# EAGLE board FPGA_pin_demo (EAGLE 5.10)
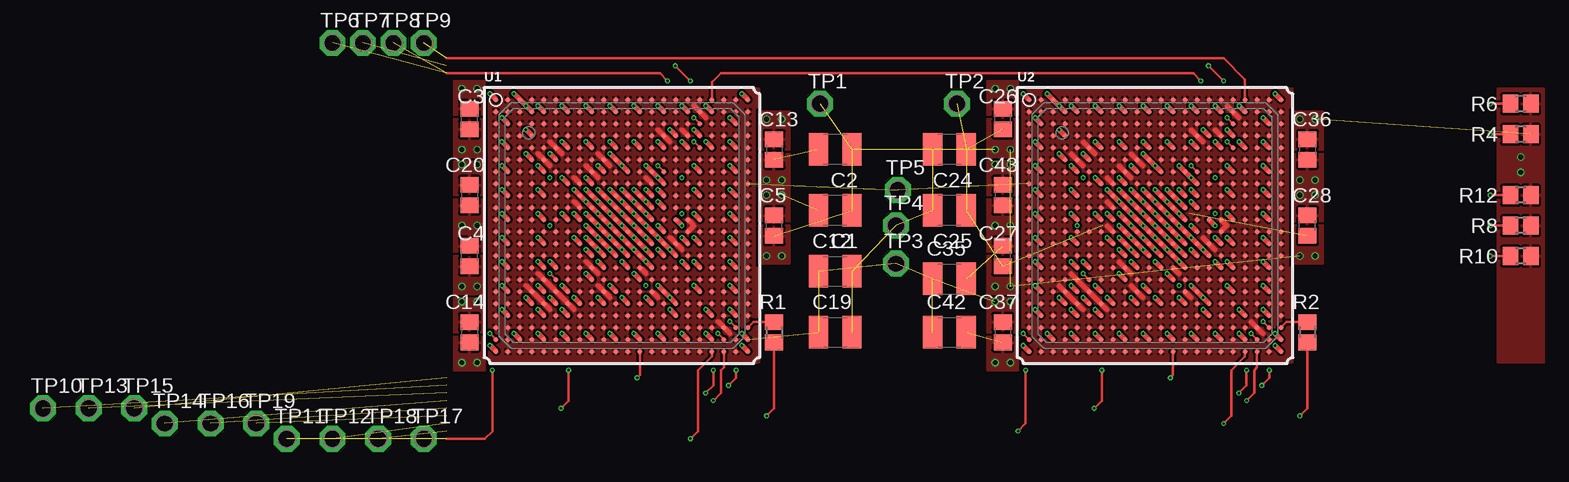
[diagram p5: board, top side]
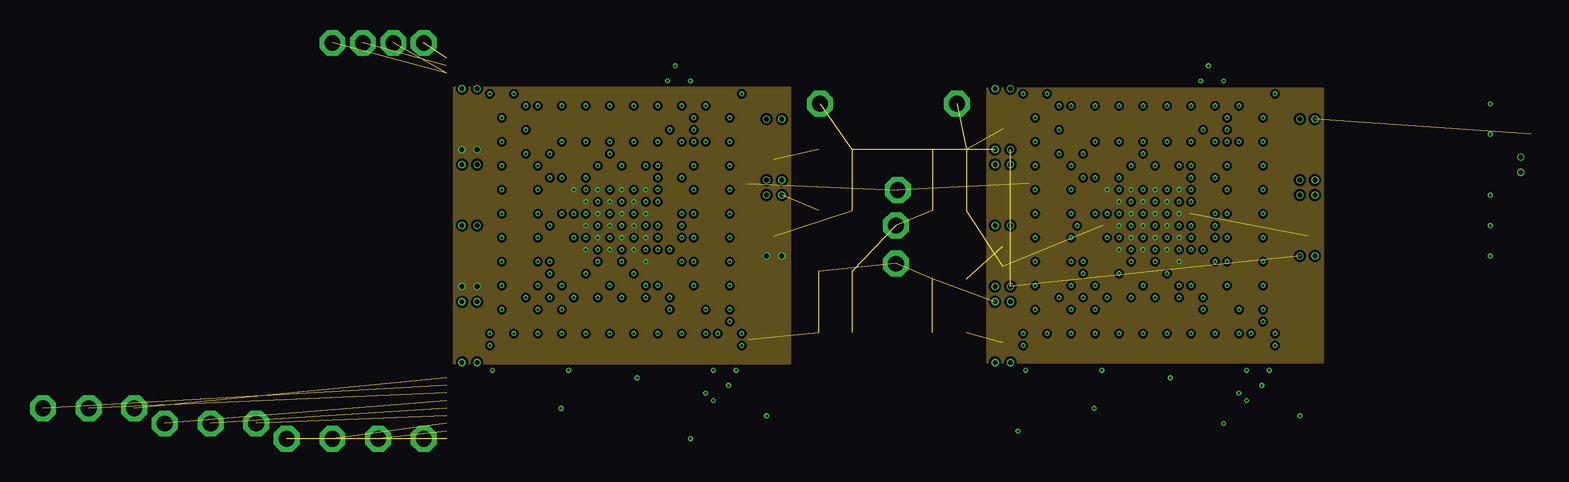
[diagram p6: board, inner layer VCCINT]
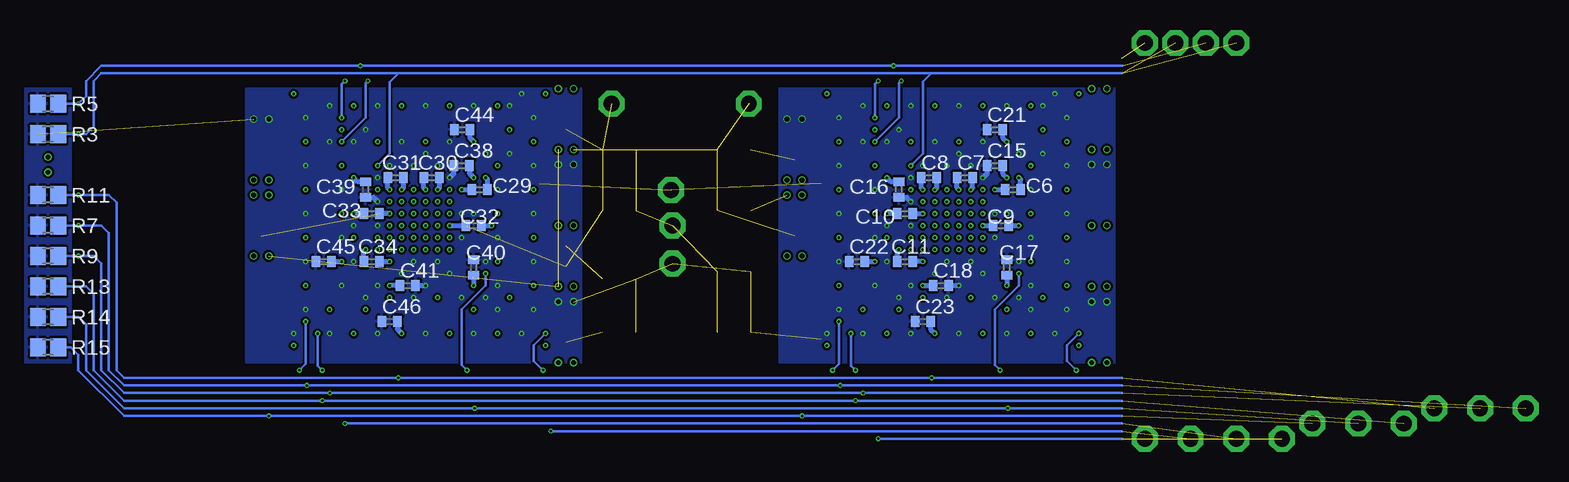
[diagram p7: board, bottom side, seen from below]

No outline drawn. Coordinates in mm, seen from the top.
Copper layers (1+2*15+16): Route1 0.07mm / dielectric 0.11mm / $GND 0.07mm / dielectric 0.7mm / VCCINT 0.07mm / dielectric 0.11mm / Bottom 0.07mm
Design rules "pcbcart": minimum track width 0.2mm, minimum drill 0.2mm, track to track 0.2mm, track to pad 0.2mm, pad to pad 0.2mm, via to via 0.2mm, smd to smd 0.2mm, copper to edge 0.3mm, drill to drill 0.2mm, minimum pad ring 0.1mm, minimum via ring 0.1mm, stop-mask expansion 0.075mm, vias tented up to drill 0mil, thermal gap 0.2mm

## Footprints (pad centres in the part's own frame; a part is rotated, then mirrored left to right if it is on the bottom)
C3225 = smd 1.6 x 2.7: 1 -1.4,0; 2 1.4,0
C2012 = smd 1.3 x 1.5: 1 -0.85,0; 2 0.85,0
C1005 = smd 0.7 x 0.9: 1 -0.65,0; 2 0.65,0
R2012 = smd 1.3 x 1.5: 1 -0.85,0; 2 0.85,0
P1-13 = drill 1.321 pad 2.159 octagon: TP 0,0
FG484 = smd 0.4 x 0.4: A1 -10.5,10.5; A2 -9.5,10.5; A3 -8.5,10.5; A4 -7.5,10.5; A5 -6.5,10.5; A6 -5.5,10.5; A7 -4.5,10.5; A8 -3.5,10.5; A9 -2.5,10.5; A10 -1.5,10.5; A11 -0.5,10.5; A12 0.5,10.5; A13 1.5,10.5; A14 2.5,10.5; A15 3.5,10.5; A16 4.5,10.5; A17 5.5,10.5; A18 6.5,10.5; A19 7.5,10.5; A20 8.5,10.5; A21 9.5,10.5; A22 10.5,10.5; AA1 -10.5,-9.5; AA2 -9.5,-9.5; AA3 -8.5,-9.5; AA4 -7.5,-9.5; AA5 -6.5,-9.5; AA6 -5.5,-9.5; AA7 -4.5,-9.5; AA8 -3.5,-9.5; AA9 -2.5,-9.5; AA10 -1.5,-9.5; AA11 -0.5,-9.5; AA12 0.5,-9.5; AA13 1.5,-9.5; AA14 2.5,-9.5; AA15 3.5,-9.5; AA16 4.5,-9.5; AA17 5.5,-9.5; AA18 6.5,-9.5; AA19 7.5,-9.5; AA20 8.5,-9.5; AA21 9.5,-9.5; AA22 10.5,-9.5; AB1 -10.5,-10.5; AB2 -9.5,-10.5; AB3 -8.5,-10.5; AB4 -7.5,-10.5; AB5 -6.5,-10.5; AB6 -5.5,-10.5; AB7 -4.5,-10.5; AB8 -3.5,-10.5; AB9 -2.5,-10.5; AB10 -1.5,-10.5; AB11 -0.5,-10.5; AB12 0.5,-10.5; AB13 1.5,-10.5; AB14 2.5,-10.5; AB15 3.5,-10.5; AB16 4.5,-10.5; AB17 5.5,-10.5; AB18 6.5,-10.5; AB19 7.5,-10.5; AB20 8.5,-10.5; AB21 9.5,-10.5; AB22 10.5,-10.5; B1 -10.5,9.5; B2 -9.5,9.5; B3 -8.5,9.5; B4 -7.5,9.5; B5 -6.5,9.5; B6 -5.5,9.5; B7 -4.5,9.5; B8 -3.5,9.5; B9 -2.5,9.5; B10 -1.5,9.5; B11 -0.5,9.5; B12 0.5,9.5; B13 1.5,9.5; B14 2.5,9.5; B15 3.5,9.5; B16 4.5,9.5; B17 5.5,9.5; B18 6.5,9.5; B19 7.5,9.5; B20 8.5,9.5; B21 9.5,9.5; B22 10.5,9.5; C1 -10.5,8.5; C2 -9.5,8.5; C3 -8.5,8.5; C4 -7.5,8.5; C5 -6.5,8.5; C6 -5.5,8.5; C7 -4.5,8.5; C8 -3.5,8.5; C9 -2.5,8.5; C10 -1.5,8.5; C11 -0.5,8.5; C12 0.5,8.5; C13 1.5,8.5; C14 2.5,8.5; C15 3.5,8.5; C16 4.5,8.5; C17 5.5,8.5; C18 6.5,8.5; C19 7.5,8.5; C20 8.5,8.5; C21 9.5,8.5; C22 10.5,8.5; D1 -10.5,7.5; D2 -9.5,7.5; D3 -8.5,7.5; D4 -7.5,7.5; D5 -6.5,7.5; D6 -5.5,7.5; D7 -4.5,7.5; D8 -3.5,7.5; D9 -2.5,7.5; D10 -1.5,7.5; D11 -0.5,7.5; D12 0.5,7.5; D13 1.5,7.5; D14 2.5,7.5; D15 3.5,7.5; D16 4.5,7.5; D17 5.5,7.5; D18 6.5,7.5; D19 7.5,7.5; D20 8.5,7.5; D21 9.5,7.5; D22 10.5,7.5; E1 -10.5,6.5; E2 -9.5,6.5; E3 -8.5,6.5; E4 -7.5,6.5; E5 -6.5,6.5; E6 -5.5,6.5; E7 -4.5,6.5; E8 -3.5,6.5; E9 -2.5,6.5; E10 -1.5,6.5; E11 -0.5,6.5; E12 0.5,6.5; E13 1.5,6.5; E14 2.5,6.5; E15 3.5,6.5; E16 4.5,6.5; E17 5.5,6.5; E18 6.5,6.5; E19 7.5,6.5; E20 8.5,6.5; E21 9.5,6.5; E22 10.5,6.5; F1 -10.5,5.5; F2 -9.5,5.5; F3 -8.5,5.5; F4 -7.5,5.5; F5 -6.5,5.5; F6 -5.5,5.5; F7 -4.5,5.5; F8 -3.5,5.5; F9 -2.5,5.5; F10 -1.5,5.5; F11 -0.5,5.5; F12 0.5,5.5; F13 1.5,5.5; F14 2.5,5.5; F15 3.5,5.5; F16 4.5,5.5; F17 5.5,5.5; F18 6.5,5.5; F19 7.5,5.5; F20 8.5,5.5; F21 9.5,5.5; F22 10.5,5.5; G1 -10.5,4.5; G2 -9.5,4.5; G3 -8.5,4.5; G4 -7.5,4.5; G5 -6.5,4.5; G6 -5.5,4.5; G7 -4.5,4.5; G8 -3.5,4.5; G9 -2.5,4.5; G10 -1.5,4.5; G11 -0.5,4.5; G12 0.5,4.5; G13 1.5,4.5; G14 2.5,4.5; G15 3.5,4.5; G16 4.5,4.5; G17 5.5,4.5; G18 6.5,4.5; G19 7.5,4.5; G20 8.5,4.5; G21 9.5,4.5; G22 10.5,4.5; H1 -10.5,3.5; H2 -9.5,3.5; H3 -8.5,3.5; H4 -7.5,3.5; H5 -6.5,3.5; H6 -5.5,3.5; H7 -4.5,3.5; H8 -3.5,3.5; H9 -2.5,3.5; H10 -1.5,3.5; H11 -0.5,3.5; H12 0.5,3.5; H13 1.5,3.5; H14 2.5,3.5; H15 3.5,3.5; H16 4.5,3.5; H17 5.5,3.5; H18 6.5,3.5; H19 7.5,3.5; H20 8.5,3.5; H21 9.5,3.5; H22 10.5,3.5; J1 -10.5,2.5; J2 -9.5,2.5; J3 -8.5,2.5; J4 -7.5,2.5; J5 -6.5,2.5; J6 -5.5,2.5; J7 -4.5,2.5; J8 -3.5,2.5; J9 -2.5,2.5; J10 -1.5,2.5; J11 -0.5,2.5; J12 0.5,2.5; J13 1.5,2.5; J14 2.5,2.5; J15 3.5,2.5; J16 4.5,2.5; J17 5.5,2.5; J18 6.5,2.5; J19 7.5,2.5; J20 8.5,2.5; J21 9.5,2.5; J22 10.5,2.5; K1 -10.5,1.5; K2 -9.5,1.5; K3 -8.5,1.5; K4 -7.5,1.5; K5 -6.5,1.5; K6 -5.5,1.5; K7 -4.5,1.5; K8 -3.5,1.5; K9 -2.5,1.5; K10 -1.5,1.5; K11 -0.5,1.5; K12 0.5,1.5; K13 1.5,1.5; K14 2.5,1.5; K15 3.5,1.5; K16 4.5,1.5; K17 5.5,1.5; K18 6.5,1.5; K19 7.5,1.5; K20 8.5,1.5; K21 9.5,1.5; K22 10.5,1.5; L1 -10.5,0.5; L2 -9.5,0.5; L3 -8.5,0.5; L4 -7.5,0.5; L5 -6.5,0.5; L6 -5.5,0.5; L7 -4.5,0.5; L8 -3.5,0.5; L9 -2.5,0.5; L10 -1.5,0.5; L11 -0.5,0.5; L12 0.5,0.5; L13 1.5,0.5; L14 2.5,0.5; L15 3.5,0.5; L16 4.5,0.5; L17 5.5,0.5; L18 6.5,0.5; L19 7.5,0.5; L20 8.5,0.5; L21 9.5,0.5; L22 10.5,0.5; M1 -10.5,-0.5; M2 -9.5,-0.5; M3 -8.5,-0.5; M4 -7.5,-0.5; M5 -6.5,-0.5; M6 -5.5,-0.5; M7 -4.5,-0.5; M8 -3.5,-0.5; M9 -2.5,-0.5; M10 -1.5,-0.5; M11 -0.5,-0.5; M12 0.5,-0.5; M13 1.5,-0.5; M14 2.5,-0.5; M15 3.5,-0.5; M16 4.5,-0.5; M17 5.5,-0.5; M18 6.5,-0.5; M19 7.5,-0.5; M20 8.5,-0.5; M21 9.5,-0.5; M22 10.5,-0.5; N1 -10.5,-1.5; N2 -9.5,-1.5; N3 -8.5,-1.5; N4 -7.5,-1.5; N5 -6.5,-1.5; N6 -5.5,-1.5; N7 -4.5,-1.5; N8 -3.5,-1.5; N9 -2.5,-1.5; N10 -1.5,-1.5; N11 -0.5,-1.5; N12 0.5,-1.5; N13 1.5,-1.5; N14 2.5,-1.5; N15 3.5,-1.5; N16 4.5,-1.5; N17 5.5,-1.5; N18 6.5,-1.5; N19 7.5,-1.5; N20 8.5,-1.5; N21 9.5,-1.5; N22 10.5,-1.5; P1 -10.5,-2.5; P2 -9.5,-2.5; P3 -8.5,-2.5; P4 -7.5,-2.5; P5 -6.5,-2.5; P6 -5.5,-2.5; P7 -4.5,-2.5; P8 -3.5,-2.5; P9 -2.5,-2.5; P10 -1.5,-2.5; P11 -0.5,-2.5; P12 0.5,-2.5; P13 1.5,-2.5; P14 2.5,-2.5; P15 3.5,-2.5; P16 4.5,-2.5; P17 5.5,-2.5; P18 6.5,-2.5; P19 7.5,-2.5; P20 8.5,-2.5; P21 9.5,-2.5; P22 10.5,-2.5; R1 -10.5,-3.5; R2 -9.5,-3.5; R3 -8.5,-3.5; R4 -7.5,-3.5; R5 -6.5,-3.5; R6 -5.5,-3.5; R7 -4.5,-3.5; R8 -3.5,-3.5; R9 -2.5,-3.5; R10 -1.5,-3.5; R11 -0.5,-3.5; R12 0.5,-3.5; R13 1.5,-3.5; R14 2.5,-3.5; R15 3.5,-3.5; R16 4.5,-3.5; R17 5.5,-3.5; R18 6.5,-3.5; R19 7.5,-3.5; R20 8.5,-3.5; R21 9.5,-3.5; R22 10.5,-3.5; T1 -10.5,-4.5; T2 -9.5,-4.5; T3 -8.5,-4.5; T4 -7.5,-4.5; T5 -6.5,-4.5; T6 -5.5,-4.5; T7 -4.5,-4.5; T8 -3.5,-4.5; T9 -2.5,-4.5; T10 -1.5,-4.5; T11 -0.5,-4.5; T12 0.5,-4.5; T13 1.5,-4.5; T14 2.5,-4.5; T15 3.5,-4.5; T16 4.5,-4.5; T17 5.5,-4.5; T18 6.5,-4.5; T19 7.5,-4.5; T20 8.5,-4.5; T21 9.5,-4.5; T22 10.5,-4.5; U1 -10.5,-5.5; U2 -9.5,-5.5; U3 -8.5,-5.5; U4 -7.5,-5.5; U5 -6.5,-5.5; U6 -5.5,-5.5; U7 -4.5,-5.5; U8 -3.5,-5.5; U9 -2.5,-5.5; U10 -1.5,-5.5; U11 -0.5,-5.5; U12 0.5,-5.5; U13 1.5,-5.5; U14 2.5,-5.5; U15 3.5,-5.5; U16 4.5,-5.5; U17 5.5,-5.5; U18 6.5,-5.5; U19 7.5,-5.5; U20 8.5,-5.5; U21 9.5,-5.5; U22 10.5,-5.5; V1 -10.5,-6.5; V2 -9.5,-6.5; V3 -8.5,-6.5; V4 -7.5,-6.5; V5 -6.5,-6.5; V6 -5.5,-6.5; V7 -4.5,-6.5; V8 -3.5,-6.5; V9 -2.5,-6.5; V10 -1.5,-6.5; V11 -0.5,-6.5; V12 0.5,-6.5; V13 1.5,-6.5; V14 2.5,-6.5; V15 3.5,-6.5; V16 4.5,-6.5; V17 5.5,-6.5; V18 6.5,-6.5; V19 7.5,-6.5; V20 8.5,-6.5; V21 9.5,-6.5; V22 10.5,-6.5; W1 -10.5,-7.5; W2 -9.5,-7.5; W3 -8.5,-7.5; W4 -7.5,-7.5; W5 -6.5,-7.5; W6 -5.5,-7.5; W7 -4.5,-7.5; W8 -3.5,-7.5; W9 -2.5,-7.5; W10 -1.5,-7.5; W11 -0.5,-7.5; W12 0.5,-7.5; W13 1.5,-7.5; W14 2.5,-7.5; W15 3.5,-7.5; W16 4.5,-7.5; W17 5.5,-7.5; W18 6.5,-7.5; W19 7.5,-7.5; W20 8.5,-7.5; W21 9.5,-7.5; W22 10.5,-7.5; Y1 -10.5,-8.5; Y2 -9.5,-8.5; Y3 -8.5,-8.5; Y4 -7.5,-8.5; Y5 -6.5,-8.5; Y6 -5.5,-8.5; Y7 -4.5,-8.5; Y8 -3.5,-8.5; Y9 -2.5,-8.5; Y10 -1.5,-8.5; Y11 -0.5,-8.5; Y12 0.5,-8.5; Y13 1.5,-8.5; Y14 2.5,-8.5; Y15 3.5,-8.5; Y16 4.5,-8.5; Y17 5.5,-8.5; Y18 6.5,-8.5; Y19 7.5,-8.5; Y20 8.5,-8.5; Y21 9.5,-8.5; Y22 10.5,-8.5

## Placement (x,y rotation side)
C1  100u  [C3225]  -26.67,1.27 180 top
C2  100u  [C3225]  -26.67,6.35 180 top
C3  4u7  [C2012]  -57.15,8.89 90 top
C4  4u7  [C2012]  -57.15,-2.54 90 top
C5  4u7  [C2012]  -31.75,0 90 top
C6  470n  [C1005]  -49.95,3 0 bottom
C7  470n  [C1005]  -45.95,4 180 bottom
C8  470n  [C1005]  -42.95,4 0 bottom
C9  470n  [C1005]  -48.95,0 0 bottom
C10  470n  [C1005]  -40.95,1 180 bottom
C11  470n  [C1005]  -40.95,-3 180 bottom
C12  100u  [C3225]  -26.67,-3.81 0 top
C13  4u7  [C2012]  -31.75,6.35 270 top
C14  4u7  [C2012]  -57.15,-8.89 270 top
C15  470n  [C1005]  -48.45,5 0 bottom
C16  470n  [C1005]  -40.45,3 90 bottom
C17  470n  [C1005]  -49.45,-3.5 270 bottom
C18  470n  [C1005]  -43.95,-5 180 bottom
C19  100u  [C3225]  -26.67,-8.89 0 top
C20  4u7  [C2012]  -57.15,2.54 270 top
C21  470n  [C1005]  -48.45,8 0 bottom
C22  470n  [C1005]  -36.95,-3 0 bottom
C23  470n  [C1005]  -42.45,-8 0 bottom
C24  100u  [C3225]  -17.14,6.35 180 top
C25  100u  [C3225]  -17.14,1.27 180 top
C26  4u7  [C2012]  -12.7,8.89 90 top
C27  4u7  [C2012]  -12.7,-2.54 90 top
C28  4u7  [C2012]  12.7,0 90 top
C29  470n  [C1005]  -5.5,3 0 bottom
C30  470n  [C1005]  -1.5,4 180 bottom
C31  470n  [C1005]  1.5,4 0 bottom
C32  470n  [C1005]  -5,0 0 bottom
C33  470n  [C1005]  3.5,1 180 bottom
C34  470n  [C1005]  3.5,-3 180 bottom
C35  100u  [C3225]  -17.14,-4.45 0 top
C36  4u7  [C2012]  12.7,6.35 270 top
C37  4u7  [C2012]  -12.7,-8.89 270 top
C38  470n  [C1005]  -4,5 0 bottom
C39  470n  [C1005]  4,3 90 bottom
C40  470n  [C1005]  -5,-3.5 270 bottom
C41  470n  [C1005]  0.5,-5 180 bottom
C42  100u  [C3225]  -17.14,-8.89 0 top
C43  4u7  [C2012]  -12.7,2.54 270 top
C44  470n  [C1005]  -4.05,8 0 bottom
C45  470n  [C1005]  7.5,-3 0 bottom
C46  470n  [C1005]  2,-8 0 bottom
R1  0R  [R2012]  -31.75,-8.89 270 top
R2  0R  [R2012]  12.7,-8.89 270 top
R3  100R  [R2012]  30.48,7.62 180 bottom
R4  100R  [R2012]  30.48,7.62 180 top
R5  100R  [R2012]  30.48,10.16 180 bottom
R6  100R  [R2012]  30.48,10.16 180 top
R7  100R  [R2012]  30.48,0 180 bottom
R8  100R  [R2012]  30.48,0 180 top
R9  100R  [R2012]  30.48,-2.54 180 bottom
R10  100R  [R2012]  30.48,-2.54 180 top
R11  100R  [R2012]  30.48,2.54 180 bottom
R12  100R  [R2012]  30.48,2.54 180 top
R13  4k7  [R2012]  30.48,-5.08 180 bottom
R14  4k7  [R2012]  30.48,-7.62 180 bottom
R15  4k7  [R2012]  30.48,-10.16 180 bottom
TP1  TPPAD1-13  [P1-13]  -27.94,10.16 0 top
TP2  TPPAD1-13  [P1-13]  -16.51,10.16 0 top
TP3  TPPAD1-13  [P1-13]  -21.59,-3.17 0 top
TP4  TPPAD1-13  [P1-13]  -21.59,0 0 top
TP5  TPPAD1-13  [P1-13]  -21.45,2.96 0 top
TP6  TPPAD1-13  [P1-13]  -68.58,15.24 0 top
TP7  TPPAD1-13  [P1-13]  -66.04,15.24 0 top
TP8  TPPAD1-13  [P1-13]  -63.5,15.24 0 top
TP9  TPPAD1-13  [P1-13]  -60.96,15.24 0 top
TP10  TPPAD1-13  [P1-13]  -92.71,-15.24 0 top
TP11  TPPAD1-13  [P1-13]  -72.39,-17.78 0 top
TP12  TPPAD1-13  [P1-13]  -68.58,-17.78 0 top
TP13  TPPAD1-13  [P1-13]  -88.9,-15.24 0 top
TP14  TPPAD1-13  [P1-13]  -82.55,-16.51 0 top
TP15  TPPAD1-13  [P1-13]  -85.09,-15.24 0 top
TP16  TPPAD1-13  [P1-13]  -78.74,-16.51 0 top
TP17  TPPAD1-13  [P1-13]  -60.96,-17.78 0 top
TP18  TPPAD1-13  [P1-13]  -64.77,-17.78 0 top
TP19  TPPAD1-13  [P1-13]  -74.93,-16.51 0 top
U1  6SLX150FGG484  [FG484]  -44.45,0 0 top
U2  6SLX150FGG484  [FG484]  0,0 0 top

## Tracks (layer width: path | path; a pad name or v marks a point on that pad's centre or on a via)
!IRQ  (via drill 0.2)  (1 unrouted)
  Route1 0.2: v-50.45,-4 U1.T6 | U2.T6 v-6,-4 | v-49.53,-15.24 -48.9,-14.61 v-48.9,-12.06 | v-5.08,-15.24 -4.45,-14.61 v-4.45,-12.06
  Bottom 0.2: v-50.45,-4 -50.45,-5 -48.45,-7 -48.45,-11.62 v-48.9,-12.06 | v-6,-4 -6,-5 -4,-7 -4,-11.62 v-4.45,-12.06 | -59.05,-15.24 v-49.53,-15.24 v-5.08,-15.24 24.13,-15.24 27.3,-12.06 27.3,-8.26 27.94,-7.62 R14.1
!PROGRAM0  (via drill 0.2)  (1 unrouted)
  Route1 0.2: U1.AA1 v-55.45,-9 | -59.05,-17.78 -55.88,-17.78 -55.24,-17.14 v-55.24,-12.06
  Bottom 0.2: v-55.45,-9 -54.45,-10 -54.45,-11.27 v-55.24,-12.06
!PROGRAM1  (via drill 0.2)  (1 unrouted)
  Route1 0.2: v-11,-9 U2.AA1 | v-11.43,-17.14 -10.79,-16.51 v-10.79,-12.06
  Bottom 0.2: v-11,-9 -10,-10 -10,-11.27 v-10.79,-12.06 | v-11.43,-17.14 -59.05,-17.14
CLK  (via drill 0.2)  (1 unrouted)
  Route1 0.2: v-43.18,-12.7 -42.95,-12.47 U1.AB13 | v1.27,-12.7 1.5,-12.47 U2.AB13 | v27.94,2.54 R11.1
  Bottom 0.2: -59.05,-12.7 v-43.18,-12.7 v1.27,-12.7 24.13,-12.7 24.77,-12.06 24.77,1.91 25.4,2.54 v27.94,2.54 R11.1
DONE  (via drill 0.2)  (1 unrouted)
  Route1 0.2: v-32.38,-15.88 -31.75,-15.24 R1.2 | v12.06,-15.88 12.7,-15.24 R2.2
  Bottom 0.2: -59.05,-15.88 v-32.38,-15.88 v12.06,-15.88 24.13,-15.88 27.94,-12.06 27.94,-10.79 28.57,-10.16 R15.1
DONE_0
  Route1 0.2: U1.Y22 -33.49,-8.04 R1.1
DONE_1
  Route1 0.2: U2.Y22 10.96,-8.04 R2.1
GND  (via drill 0.2, 0.4)  (8 unrouted)
  Route1 0.4: v-55.45,-10 U1.AB1 | U1.AA5 v-51.45,-9 | U1.W7 v-49.45,-7 | U1.AA9 v-47.45,-9 | v-43.45,-9 U1.AA13 | U1.AA17 v-39.45,-9 | U1.W16 v-40.45,-7 | U1.V14 v-42.45,-6 | U1.V10 v-46.45,-6 | v-49.45,-5 U1.U7 | U1.V4 v-52.45,-6 | v-54.45,-5 U1.U2 | U1.R5 v-51.45,-3 | U1.N2 v-54.45,-1 | U1.L5 v-51.45,1 | v-54.45,3 U1.J2 | U1.E2 v-54.45,7 | v-52.45,8 U1.D4 | U1.B5 v-51.45,10 | v-49.45,7 U1.E7 | U1.G5 v-51.45,5 | U1.B9 v-47.45,10 | U1.E11 v-45.45,7 | U1.B13 v-43.45,10 | U1.B17 v-39.45,10 | U1.A22 v-34.45,11 | U1.E21 v-35.45,7 | U1.D18 v-38.45,8 | U1.E15 v-41.45,7 | U1.G18 v-38.45,5 | v-35.45,3 U1.J21 | U1.L18 v-38.45,1 | U1.N21 v-35.45,-1 | U1.N17 v-39.45,-1 | v-35.45,-5 U1.U21 | U1.W19 v-37.45,-7 | v-34.45,-10 U1.AB22 | v-49.45,4 U1.H7 | v-41.45,3 U1.J15 | U1.K14 v-42.45,2 U1.J13 v-43.45,3 | v-45.45,3 U1.J11 v-44.45,2 U1.K12 v-43.45,1 U1.L13 v-42.45,0 U1.M14 v-41.45,-1 U1.N15 v-40.45,-2 U1.P16 | v-38.45,-3 U1.R18 | U1.P15 v-41.45,-2 | U1.P14 v-42.45,-2 U1.N13 v-43.45,-1 U1.M12 v-44.45,0 U1.L11 v-45.45,1 U1.K10 v-46.45,2 U1.J9 v-47.45,3 | v-47.45,1 U1.L9 v-46.45,0 U1.M10 v-45.45,-1 U1.N11 v-44.45,-2 U1.P12 | U1.P10 v-46.45,-2 U1.N9 v-47.45,-1 | U1.A1 v-55.45,11 | v-11,-10 U2.AB1 | U2.AA5 v-7,-9 | U2.W7 v-5,-7 | U2.AA9 v-3,-9 | v1,-9 U2.AA13 | U2.AA17 v5,-9 | U2.W16 v4,-7 | U2.V14 v2,-6 | U2.V10 v-2,-6 | v-5,-5 U2.U7 | U2.V4 v-8,-6 | v-10,-5 U2.U2 | U2.R5 v-7,-3 | U2.N2 v-10,-1 | U2.L5 v-7,1 | v-10,3 U2.J2 | U2.E2 v-10,7 | U2.D4 v-8,8 | U2.B5 v-7,10 | U2.E7 v-5,7 | U2.G5 v-7,5 | v-3,10 U2.B9 | U2.E11 v-1,7 | U2.B13 v1,10 | v5,10 U2.B17 | v10,11 U2.A22 | U2.E21 v9,7 | U2.D18 v6,8 | U2.E15 v3,7 | U2.G18 v6,5 | U2.J21 v9,3 | U2.L18 v6,1 | U2.N21 v9,-1 | v5,-1 U2.N17 | U2.U21 v9,-5 | U2.W19 v7,-7 | U2.AB22 v10,-10 | v-5,4 U2.H7 | U2.J15 v3,3 | U2.K14 v2,2 U2.J13 v1,3
  Route1 0.4: v-1,3 U2.J11 v0,2 U2.K12 v1,1 U2.L13 v2,0 U2.M14 v3,-1 U2.N15 v4,-2 U2.P16 | v6,-3 U2.R18 | U2.P15 v3,-2 | U2.P14 v2,-2 U2.N13 v1,-1 U2.M12 v0,0 U2.L11 v-1,1 U2.K10 v-2,2 U2.J9 v-3,3 | v-3,1 U2.L9 v-2,0 U2.M10 v-1,-1 U2.N11 v0,-2 U2.P12 | U2.P10 v-2,-2 U2.N9 v-3,-1 | U2.A1 v-11,11
  Bottom 0.4: C15.2 -49.1,4.35 v-49.45,4 | C22.2 v-38.45,-3 | C11.2 -40.3,-2.15 v-40.45,-2 | C8.2 -43.6,3.15 v-43.45,3 | C7.2 -45.3,3.15 v-45.45,3 | C17.2 v-49.45,-5 | C38.2 -4.65,4.35 v-5,4 | C45.2 v6,-3 | C34.2 4.15,-2.15 v4,-2 | C31.2 0.85,3.15 v1,3 | C30.2 -0.85,3.15 v-1,3 | C40.2 v-5,-5 | C9.2 v-50.45,0 | C10.2 v-39.45,1 | C21.2 -49.1,7.35 v-49.45,7 | C6.2 -50.6,3.85 v-50.45,4 | C23.2 -43.1,-8.65 v-43.45,-9 | v-42.45,-5 C18.2 | C16.2 -39.8,3.65 v-39.45,4 | C44.2 -4.7,7.3 v-5,7 | C32.2 v-6.5,0 | C29.2 -6.15,3.85 v-6,4 | C41.2 v2,-5 | C46.2 1.35,-8.65 v1,-9 | C33.2 v5,1 | C39.2 4.65,3.65 v5,4
  other vias: -32.38,2.54 -32.38,3.81 -31.11,2.54 -31.11,3.81 -57.78,11.43 -56.52,11.43 -57.78,0 -56.52,0 -56.52,-11.43 -57.78,-11.43 -12.06,-11.43 -13.34,-11.43 -13.34,0 -12.06,0 -12.06,11.43 -13.34,11.43 13.34,3.81 12.06,3.81 12.06,2.54 13.34,2.54 30.48,4.45 30.48,5.71
  pour Route1 (rank 3): 28.57,11.43 28.57,-11.43 32.38,-11.43 32.38,11.43
  pour Route1 (rank 3): -58.42,-8.89 -58.42,-12.06 -55.88,-12.06 -55.88,-8.89
  pour Route1 (rank 3): -58.42,2.54 -58.42,-2.54 -55.88,-2.54 -55.88,2.54
  pour Route1 (rank 3): -58.42,12.06 -58.42,8.89 -55.88,8.89 -55.88,12.06
  pour Route1 (rank 3): -33.02,6.35 -33.02,0 -30.48,0 -30.48,6.35
  pour Route1 (rank 3): -13.97,12.06 -11.43,12.06 -11.43,8.89 -13.97,8.89
  pour Route1 (rank 3): -13.97,2.54 -11.43,2.54 -11.43,-2.54 -13.97,-2.54
  pour Route1 (rank 3): -13.97,-8.89 -11.43,-8.89 -11.43,-12.06 -13.97,-12.06
  pour Route1 (rank 3): 11.43,6.35 13.97,6.35 13.97,0 11.43,0
MISO  (via drill 0.2)  (1 unrouted)
  Route1 0.2: v-36.83,-14.61 -36.2,-13.97 -36.2,-12.06 -35.95,-11.82 U1.AB20 | v7.62,-14.61 8.26,-13.97 8.26,-12.06 8.5,-11.82 U2.AB20
  Bottom 0.2: -59.05,-14.61 v-36.83,-14.61 v7.62,-14.61 24.13,-14.61 26.67,-12.06 26.67,-5.71 27.3,-5.08 R13.1
MOSI  (via drill 0.2)  (1 unrouted)
  Route1 0.2: v-36.45,-9 U1.AA20 | U2.AA20 v8,-9 | v-37.47,-13.97 -36.83,-13.34 v-36.83,-12.06 | v6.99,-13.97 7.62,-13.34 v7.62,-12.06 | v27.94,-2.54 R9.1
  Bottom 0.2: -59.05,-13.97 v-37.47,-13.97 v6.99,-13.97 24.13,-13.97 26.04,-12.06 26.04,-3.17 26.67,-2.54 v27.94,-2.54 R9.1 | v-36.83,-12.06 -36.45,-11.69 v-36.45,-9 | v7.62,-12.06 8,-11.69 v8,-9
NC  (2 unrouted)
  Route1 0.4: -52.45,-5 U1.U4 U1.V5 -50.45,-7 | -48.45,-7 U1.V7 U1.U6 U1.T5 -51.45,-4 | -41.45,8 U1.D15 -40.45,7 | U1.R13 -42.45,-4 | U1.U14 -41.45,-6 | -46.45,-5 U1.U10 -45.45,-6 | U1.H8 -48.45,4 | -47.45,5 U1.G9 -46.45,4 | U1.K8 -48.45,2 | -46.45,6 U1.F10 -45.45,5 | -47.45,-3 U1.R9 -46.45,-4 | -50.45,7 U1.E6 -49.45,6 | -51.45,6 U1.F5 -50.45,5 | -40.45,-1 U1.N16 -39.45,-2 | -39.45,8 U1.D17 | -38.45,10 U1.B18 -37.45,9 | -8,-5 U2.U4 U2.V5 -6,-7 | -4,-7 U2.V7 U2.U6 U2.T5 -7,-4 | 3,8 U2.D15 4,7 | U2.R13 2,-4 | 3,-6 U2.U14 | -2,-5 U2.U10 -1,-6 | U2.H8 -4,4 | -3,5 U2.G9 -2,4 | U2.K8 -4,2 | -2,6 U2.F10 -1,5 | -3,-3 U2.R9 -2,-4 | -6,7 U2.E6 -5,6 | -7,6 U2.F5 -6,5 | 4,-1 U2.N16 5,-2 | U2.D17 5,8 | 6,10 U2.B18 7,9 | U2.M8 -4,0 | U2.L17 6,0 U2.M17 | 8,-8 U2.Y20 9,-9 | U1.M17 -38.45,0 U1.L17 | -36.45,-8 U1.Y20 -35.45,-9 | U1.H14 -42.45,4
  pour Route1 (rank 4): -55.88,11.43 -33.02,11.43 -33.02,-11.43 -55.88,-11.43
  pour Route1 (rank 4): -11.43,11.43 11.43,11.43 11.43,-11.43 -11.43,-11.43
SCLK  (via drill 0.2)  (1 unrouted)
  Route1 0.2: v-35.45,-8 U1.Y21 | U2.Y21 v9,-8 | v-35.56,-13.34 -34.92,-12.7 v-34.92,-12.06 | v8.89,-13.34 9.53,-12.7 v9.53,-12.06 | v27.94,0 R7.1
  Bottom 0.2: -59.05,-13.34 v-35.56,-13.34 v8.89,-13.34 24.13,-13.34 25.4,-12.06 25.4,-0.64 26.04,0 v27.94,0 R7.1 | v-34.92,-12.06 -35.45,-11.54 v-35.45,-8 | v9.53,-12.06 9,-11.54 v9,-8
SSEL0  (via drill 0.2)  (1 unrouted)
  Route1 0.2: -36.95,-10.73 U1.AB19 -36.95,-10.91 -38.1,-12.06 -38.1,-17.14 v-38.73,-17.78
  Bottom 0.2: v-38.73,-17.78 -59.05,-17.78
SSEL1  (via drill 0.2)  (1 unrouted)
  Route1 0.2: 7.5,-10.73 U2.AB19 7.5,-10.91 6.35,-12.06 6.35,-15.88 v5.71,-16.51
  Bottom 0.2: v5.71,-16.51 -59.05,-16.51
TCK  (via drill 0.2)  (1 unrouted)
  Route1 0.2: v-41.45,5 U1.G15 | U2.G15 v3,5 | v27.94,7.62 R3.1
  Bottom 0.2: v-41.45,5 -42.45,6 -42.45,12 -43.15,12.7 | v3,5 2,6 2,11.97 1.27,12.7 | -43.15,12.7 -59.05,12.7 | 1.27,12.7 -43.15,12.7 | 1.27,12.7 26.04,12.7 26.67,12.06 26.67,8.26 27.3,7.62 v27.94,7.62 R3.1
TDI0  (via drill 0.2)  (1 unrouted)
  Route1 0.2: v-38.45,7 U1.E18 | v-40.64,12.06 -41.27,12.7 -59.05,12.7
  Bottom 0.2: v-38.45,7 -40.45,9 -40.45,11.88 v-40.64,12.06
TDO0I1  (via drill 0.2)
  Route1 0.2: U2.E18 v6,7 | U1.A19 -36.95,11.95 -36.2,12.7 3.17,12.7 v3.81,12.06
  Bottom 0.2: v6,7 4,9 4,11.88 v3.81,12.06
TDO1  (1 unrouted)
  Route1 0.2: -59.05,13.97 5.71,13.97 7.5,12.19 U2.A19
TMS  (via drill 0.2)  (1 unrouted)
  Route1 0.2: v-38.45,9 U1.C18 | U2.C18 v6,9 | v-40.01,13.34 v-38.73,12.06 | v5.71,12.06 v4.45,13.34 | v27.94,10.16 R5.1
  Bottom 0.2: -59.09,13.34 v-40.01,13.34 v4.45,13.34 26.04,13.34 27.3,12.06 27.3,10.79 v27.94,10.16 R5.1 | v-38.73,12.06 -38.45,11.78 v-38.45,9 | v5.71,12.06 6,11.78 v6,9
VCCINT0  (via drill 0.2, 0.4)  (6 unrouted)
  Route1 0.4: v-46.45,3 U1.J10 v-45.45,2 U1.K11 v-44.45,1 U1.L12 v-43.45,0 U1.M13 v-42.45,-1 U1.N14 | U1.R14 v-42.45,-3 U1.P13 v-43.45,-2 U1.N12 v-44.45,-1 U1.M11 v-45.45,0 U1.L10 v-46.45,1 U1.K9 v-47.45,2 U1.J8 v-48.45,3 | U1.P11 v-45.45,-2 U1.N10 v-46.45,-1 U1.M9 v-47.45,0 | U1.P9 v-47.45,-2 | U1.L14 v-42.45,1 U1.K13 v-43.45,2 U1.J12 v-44.45,3 | v-42.45,3 U1.J14
  Bottom 0.4: v-42.45,-3 C11.1 | C7.1 -46.6,3.15 v-46.45,3 | C8.1 -42.3,3.15 v-42.45,3 | v-47.45,0 C9.1 | C10.1 v-42.45,1 | v-48.45,3 C6.1
  other vias: -32.38,-2.54 -31.11,-2.54 -57.78,-5.08 -56.52,-5.08 -57.78,6.35 -56.52,6.35 -12.06,-5.08 -13.34,-5.08 -12.06,6.35 -13.34,6.35 13.34,-2.54 12.06,-2.54
  pour VCCINT: -30.45,11.5 -58.45,11.5 -58.45,-11.5 -30.45,-11.5
  pour Route1: -58.42,-2.54 -58.42,-5.71 -55.88,-5.71 -55.88,-2.54
  pour Route1: -58.42,8.89 -58.42,5.71 -55.88,5.71 -55.88,8.89
  pour Route1: -33.02,0 -33.02,-3.17 -30.48,-3.17 -30.48,0
  pour Route1: -13.97,8.89 -11.43,8.89 -11.43,5.71 -13.97,5.71
  pour Route1: -13.97,-2.54 -11.43,-2.54 -11.43,-5.71 -13.97,-5.71
  pour Route1: 11.43,0 13.97,0 13.97,-3.17 11.43,-3.17
VCCINT1  (via drill 0.2)  (6 unrouted)
  Route1 0.4: v-2,3 U2.J10 v-1,2 U2.K11 v0,1 U2.L12 v1,0 U2.M13 v2,-1 U2.N14 | U2.R14 v2,-3 U2.P13 v1,-2 U2.N12 v0,-1 U2.M11 v-1,0 U2.L10 v-2,1 U2.K9 v-3,2 U2.J8 v-4,3 | U2.P11 v-1,-2 U2.N10 v-2,-1 U2.M9 v-3,0 | U2.P9 v-3,-2 | U2.L14 v2,1 U2.K13 v1,2 U2.J12 v0,3 | U2.J14 v2,3
  Bottom 0.4: v-3,0 C32.1 | C34.1 v2,-3 | v2,1 C33.1 | C30.1 -2.15,3.15 v-2,3 | C31.1 2.15,3.15 v2,3 | v-4,3 C29.1
  pour VCCINT: -13.97,11.43 13.97,11.43 13.97,-11.43 -13.97,-11.43
VCCIO  (via drill 0.2, 0.4)  (7 unrouted)
  Route1 0.4: U1.E13 v-43.45,7 | v-42.45,5 U1.G14 v-41.45,4 U1.H15 | U1.L16 v-39.45,0 | U1.J18 v-38.45,3 | U1.N18 v-38.45,-1 | U1.L21 v-35.45,1 | U1.G21 v-35.45,5 | U1.E19 v-37.45,7 | U1.E17 v-39.45,7 | U1.C21 v-35.45,9 | U1.B19 v-37.45,10 | U1.B15 v-41.45,10 | U1.B11 v-45.45,10 | U1.B7 v-49.45,10 | U1.F6 v-50.45,6 | v-52.45,10 U1.B4 | U1.A3 v-52.45,10 | v-52.45,10 v-53.45,11 | U1.C2 v-54.45,9 | U1.E9 v-47.45,7 | U1.F4 v-52.45,6 | U1.G2 v-54.45,5 | v-51.45,3 U1.J5 | U1.L7 v-49.45,1 | U1.L2 v-54.45,1 | U1.N5 v-51.45,-1 | U1.R2 v-54.45,-3 | v-51.45,-5 U1.U5 | U1.V8 v-48.45,-6 | U1.T9 v-47.45,-4 | U1.V12 v-44.45,-6 | U1.T13 v-43.45,-4 | U1.W2 v-54.45,-7 | U1.AA3 v-53.45,-9 | U1.W5 v-51.45,-7 | U1.AA7 v-49.45,-9 | U1.AA11 v-45.45,-9 | U1.AA15 v-41.45,-9 | U1.AA22 v-34.45,-9 | U1.W21 v-35.45,-7 | U1.AA19 v-37.45,-9 | U1.U18 v-38.45,-5 | U1.R17 v-39.45,-3 | U1.R21 v-35.45,-3 | U1.V16 v-40.45,-6 U1.U15 v-41.45,-5 | U1.G10 v-46.45,5 | U1.G12 v-44.45,5 U1.F11 v-45.45,6 | U1.M15 v-41.45,0 | v-40.45,8 U1.D16 | U1.L8 v-48.45,1 | U1.R6 v-50.45,-3 | U1.V6 v-50.45,-6 | U1.R10 v-46.45,-3 | U1.N8 v-48.45,-1 | v-45.45,-5 U1.U11 | U1.R12 v-44.45,-3 | v-47.45,4 U1.H9 | U2.E13 v1,7 | v2,5 U2.G14 v3,4 U2.H15 | U2.L16 v5,0 | U2.J18 v6,3 | U2.N18 v6,-1 | U2.L21 v9,1 | U2.G21 v9,5 | U2.E19 v7,7 | v5,7 U2.E17 | U2.C21 v9,9 | U2.B19 v7,10 | U2.B15 v3,10 | U2.B11 v-1,10 | U2.B7 v-5,10 | U2.F6 v-6,6 | v-8,10 U2.B4 | v-8,10 U2.A3 | v-8,10 v-9,11 | U2.C2 v-10,9 | v-3,7 U2.E9 | U2.F4 v-8,6 | U2.G2 v-10,5 | v-7,3 U2.J5 | U2.L7 v-5,1 | U2.L2 v-10,1 | U2.N5 v-7,-1 | U2.R2 v-10,-3 | v-7,-5 U2.U5 | U2.V8 v-4,-6 | U2.T9 v-3,-4 | U2.V12 v0,-6 | U2.T13 v1,-4 | U2.W2 v-10,-7 | U2.AA3 v-9,-9 | U2.W5 v-7,-7 | U2.AA7 v-5,-9 | U2.AA11 v-1,-9 | U2.AA15 v3,-9 | v10,-9 U2.AA22 | U2.W21 v9,-7 | U2.AA19 v7,-9 | U2.U18 v6,-5 | v5,-3 U2.R17
  Route1 0.4: U2.R21 v9,-3 | U2.V16 v4,-6 U2.U15 v3,-5 | U2.G10 v-2,5 | U2.G12 v0,5 U2.F11 v-1,6 | v3,2 U2.K15 | U2.M15 v3,0 | U2.D16 v4,8 | U2.L8 v-4,1 | U2.R6 v-6,-3 | U2.V6 v-6,-6 | U2.R10 v-2,-3 | U2.N8 v-4,-1 | v-1,-5 U2.U11 | U2.R12 v0,-3 | v-3,4 U2.H9 | v-41.45,2 U1.K15
  Bottom 0.4: v-47.45,4 -47.8,4.35 C15.1 | C18.1 v-45.45,-5 | C16.1 -41.1,2.35 v-41.45,2 | v-3,4 -3.35,4.35 C38.1 | C41.1 v-1,-5 | C39.1 3.35,2.35 v3,2
  other vias: -32.38,8.89 -31.11,8.89 -57.78,5.08 -56.52,5.08 -57.78,-6.35 -56.52,-6.35 -12.06,-6.35 -13.34,-6.35 -13.34,5.08 -12.06,5.08 13.34,8.89 12.06,8.89
  pour Bottom: -58.42,11.43 -30.48,11.43 -30.48,-11.43 -58.42,-11.43
  pour Bottom: -13.97,11.43 13.97,11.43 13.97,-11.43 -13.97,-11.43
  pour Route1 (rank 2): -13.97,5.71 -11.43,5.71 -11.43,2.54 -13.97,2.54
  pour Bottom: 28.57,11.43 28.57,-11.43 32.38,-11.43 32.38,11.43
  pour Route1 (rank 2): 11.43,9.53 13.97,9.53 13.97,6.35 11.43,6.35
  pour Route1 (rank 2): -13.97,-8.89 -11.43,-8.89 -11.43,-5.71 -13.97,-5.71
  pour Route1 (rank 2): -58.42,5.71 -58.42,2.54 -55.88,2.54 -55.88,5.71
  pour Route1 (rank 2): -58.42,-5.71 -58.42,-8.89 -55.88,-8.89 -55.88,-5.71
  pour Route1: -33.02,9.53 -33.02,6.35 -30.48,6.35 -30.48,9.53